# EAGLE design tinyRGB-v1 (EAGLE 5.06)
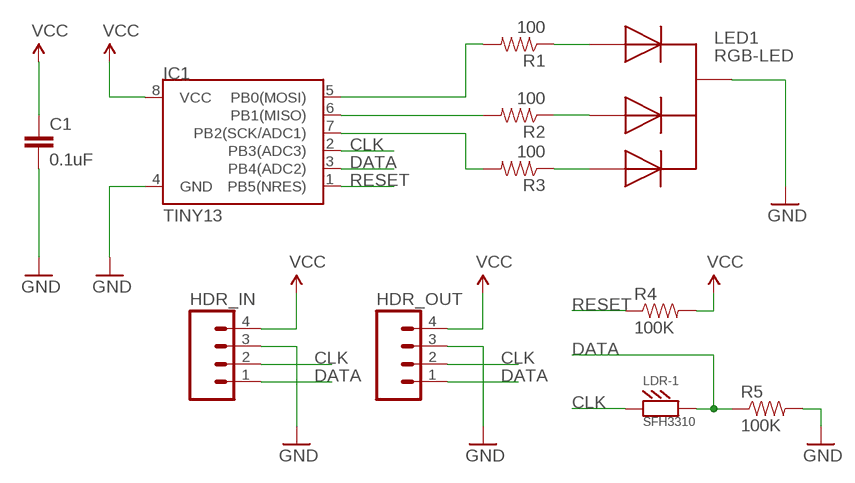
[diagram p0: schematic, sheet 1]

## Parts
C1  0.1uF  CAPPTH  [CAP-PTH-SMALL]
HDR_IN  M04PTH  [1X04]
HDR_OUT  M04PTH  [1X04]
IC1  TINY13  ATTINY13DIP  [DIP08]
LDR-1  SFH3310  LDR-906014  [LDR-906014]
LED1  RGB-LED  LL-509RGBC2E  [LL-509RGBC2EB]
R1  100  RESISTORPTH1  [AXIAL-0.3]
R2  100  RESISTORPTH1  [AXIAL-0.3]
R3  100  RESISTORPTH1  [AXIAL-0.3]
R4  100K  RESISTORPTH1  [AXIAL-0.3]
R5  100K  RESISTORPTH1  [AXIAL-0.3]

## Nets
B: LED1.P$2(B) R1.P$1
CLK: HDR_IN.2 HDR_OUT.2 IC1.2(PB3(ADC3)) LDR-1.P$1
DATA: HDR_IN.1 HDR_OUT.1 IC1.3(PB4(ADC2)) LDR-1.P$2 R5.P$1
GND: C1.2 HDR_IN.3 HDR_OUT.3 IC1.4(GND) LED1.P$4(GND) R5.P$2
N$1: IC1.5(PB0(MOSI)) R1.P$2
N$2: IC1.6(PB1(MISO)) R2.P$2
N$3: IC1.7(PB2(SCK/ADC1)) R3.P$2
R2: LED1.P$5(R) R2.P$1
R3: LED1.P$3(G) R3.P$1
RESET: IC1.1(PB5(NRES)) R4.P$1
VCC: C1.1 HDR_IN.4 HDR_OUT.4 IC1.8(VCC) R4.P$2

## Library data of the parts
C1 = SparkFun:CAP: Capacitor Standard 0603 ceramic capacitor, and 0.1" leaded capacitor.
HDR_IN HDR_OUT = SparkFun:M04: Header 4 Standard 4-pin 0.1" header. Use with straight break away headers (SKU : PRT-00116), right angle break away headers (PRT-00553), swiss pins (PRT-00743), machine pins (PRT-00117), and female headers (PRT-00115). Molex polarized connector foot print use with SKU : PRT-08231 with associated crimp pins and housings.
IC1 = SparkFun:ATTINY13
LDR-1 = alex:LDR-906014
LED1 = alex:LL-509RGBC2E
R1-R5 = SparkFun:RESISTOR: Resistor Basic schematic elements and footprints for 0603, 1206, and PTH 1/10th watt (small) resistors.

## Net classes
0 default: width 0.318 mm, drill 1.27 mm, clearance 0.318 mm

## Board
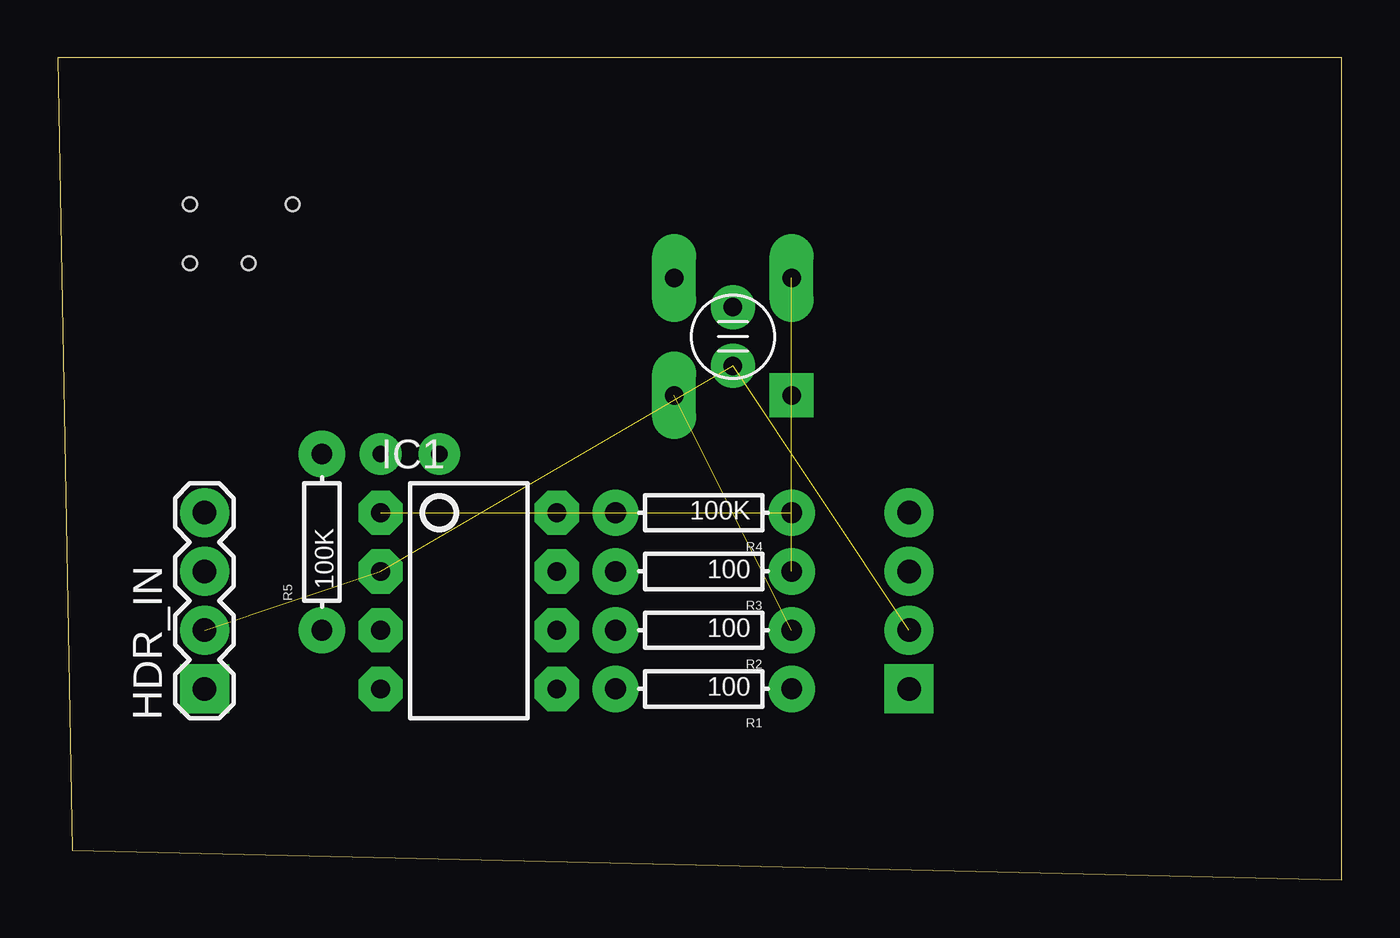
[diagram p1: board, top side]
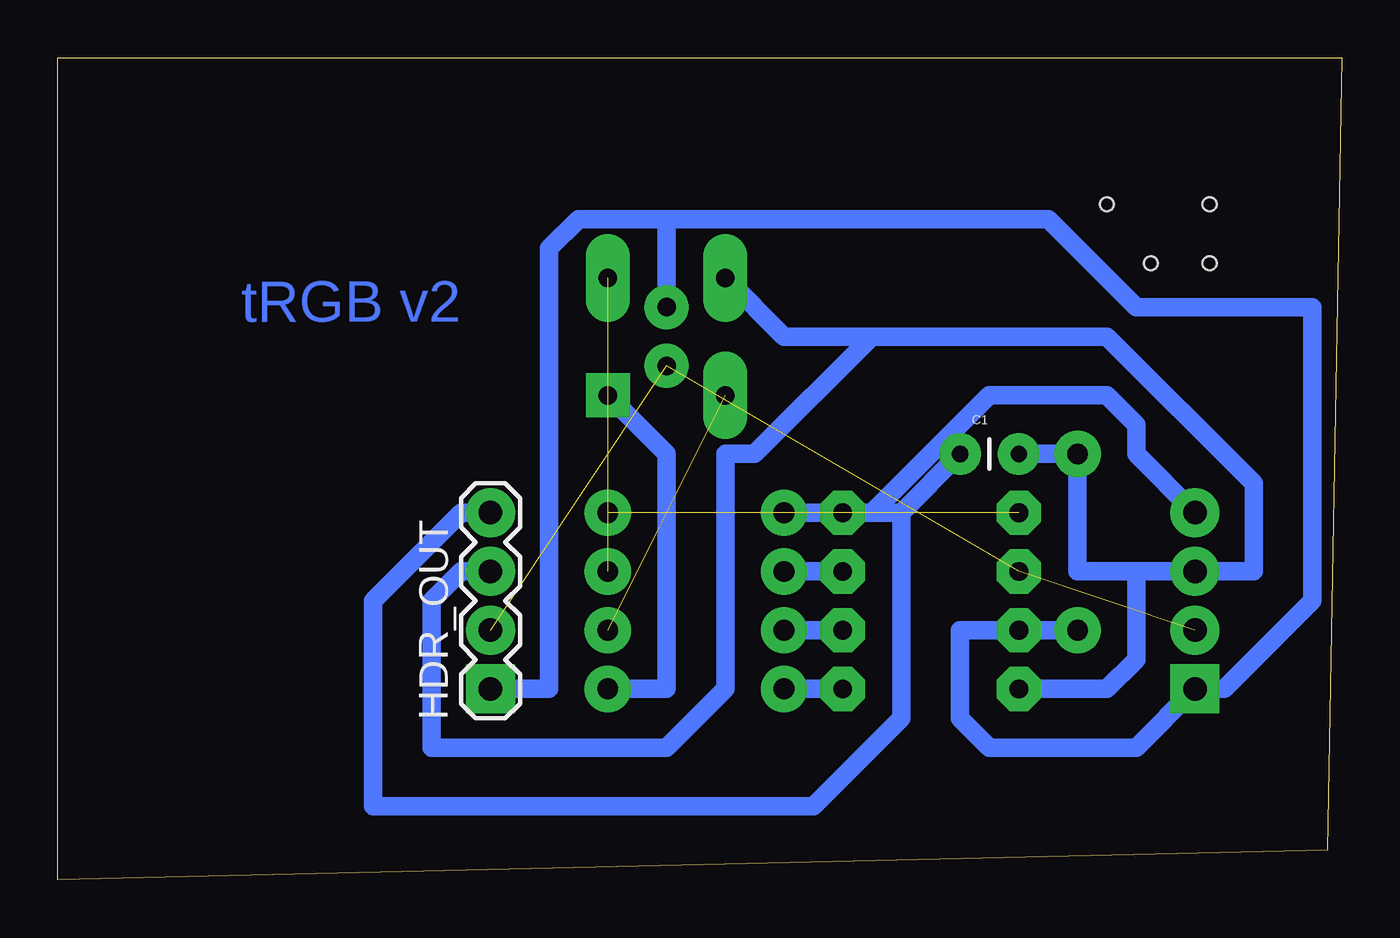
[diagram p2: board, bottom side, seen from below]

Size 55.55 x 35.55 mm. Coordinates in mm from the lower left corner, seen from the top.
Outline: 0.64,1.27 55.55,0 55.55,35.55 0,35.55 0.64,1.27
Copper layers (1*16): Top 0.035mm / dielectric 1.5mm / Bottom 0.035mm
Design rules "hobby *": minimum track width 0.8mm, minimum drill 0.8mm, track to track 0.8mm, track to pad 0.8mm, pad to pad 0.4mm, via to via 0.8mm, smd to smd 8mil, copper to edge 10mil, drill to drill 8mil, minimum pad ring 0.55mm, minimum via ring 0.6mm, stop-mask expansion 0mil, vias tented up to drill 0mil, thermal gap 10mil
Holes 0.6 mm at 5.71,29.21 10.16,29.21 5.71,26.67 8.26,26.67

### Footprints (pad centres in the part's own frame; a part is rotated, then mirrored left to right if it is on the bottom)
CAP-PTH-SMALL = drill 0.7 pad 1.651 round: 1 0,0; 2 2.54,0
1X04 = drill 1.016 pad 1.88 square: 1 0,0 | drill 1.016 pad 1.88 round: 2 2.54,0; 3 5.08,0; 4 7.62,0
DIP08 = drill 0.813 pad 1.6 octagon: 1 -3.81,-3.81; 2 -1.27,-3.81; 3 1.27,-3.81; 4 3.81,-3.81; 5 3.81,3.81; 6 1.27,3.81; 7 -1.27,3.81; 8 -3.81,3.81
LDR-906014 = drill 0.8 pad 1.27 round: P$1 0,1.27; P$2 0,-1.27
LL-509RGBC2EB = drill 0.8 square: P$2 -2.54,-2.54 | drill 0.8 long: P$3 2.54,-2.54; P$4 2.54,2.54; P$5 -2.54,2.54
AXIAL-0.3 = drill 0.9 pad 1.88 round: P$1 -3.81,0; P$2 3.81,0

### Placement (x,y rotation side)
C1  16.51,18.42 0 bottom
HDR_IN  6.35,8.26 90 top
HDR_OUT  36.83,8.26 90 bottom
IC1  17.78,12.06 270 top
LDR-1  29.21,23.5 180 top
LED1  29.21,23.5 90 top
R1  27.94,8.26 180 top
R2  27.94,10.79 180 top
R3  27.94,13.33 180 top
R4  27.94,15.88 180 top
R5  11.43,14.61 90 top

### Tracks (layer width: path | path; a pad name or v marks a point on that pad's centre or on a via)
B
  Bottom 0.8: LED1.P$2 29.21,18.42 29.21,8.26 R1.P$1
CLK  (3 unrouted)
DATA
  Bottom 0.8: R5.P$1 IC1.3 16.51,10.79 16.51,6.98 15.24,5.71 8.89,5.71 HDR_IN.1 5.08,8.26 1.27,12.06 1.27,24.77 8.89,24.77 12.7,28.58 29.21,28.58 | 29.21,28.58 LDR-1.P$2 | 29.21,28.58 33.02,28.58 34.29,27.31 34.29,8.26 HDR_OUT.1
GND
  Bottom 0.8: C1.2 R5.P$2 11.43,13.33 8.89,13.33 | LED1.P$4 24.13,23.5 20.32,23.5 | 20.32,23.5 10.16,23.5 3.81,17.15 3.81,13.33 HDR_IN.3 8.89,13.33 | IC1.4 10.16,8.26 8.89,9.53 8.89,13.33 | HDR_OUT.3 38.1,13.33 39.37,12.06 39.37,5.71 29.21,5.71 26.67,8.26 26.67,18.42 25.4,18.42 20.32,23.5
N$1
  Bottom 0.8: IC1.5 R1.P$2
N$2
  Bottom 0.8: IC1.6 R2.P$2
N$3
  Bottom 0.8: IC1.7 R3.P$2
R2  (1 unrouted)
R3  (1 unrouted)
RESET  (1 unrouted)
VCC
  Bottom 0.8: 19.05,15.88 C1.1 | 20.32,15.88 IC1.8 R4.P$2 | 20.32,15.88 19.05,15.88 | HDR_IN.4 8.89,18.42 8.89,19.69 10.16,20.96 15.24,20.96 20.32,15.88 | HDR_OUT.4 38.1,15.88 41.91,12.06 41.91,3.17 22.86,3.17 19.05,6.98 19.05,15.88

### Text on the board
Bottom: tRGB v2